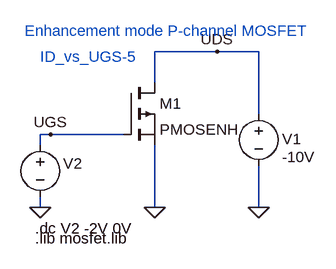
[diagram p0: schematic ID_vs_UGS-7.asc]
ID_vs_UGS-7.asc, the LTspice schematic file:
Version 4
SHEET 1 1292 680
WIRE -624 -176 -720 -176
WIRE -560 -176 -624 -176
WIRE -720 -128 -720 -176
WIRE -560 -80 -560 -176
WIRE -880 -48 -896 -48
WIRE -768 -48 -880 -48
WIRE -896 -32 -896 -48
WIRE -896 64 -896 48
WIRE -720 64 -720 -32
WIRE -560 64 -560 0
FLAG -560 64 0
FLAG -896 64 0
FLAG -720 64 0
FLAG -880 -48 UGS
FLAG -624 -176 UDS
SYMBOL voltage -560 -96 R0
WINDOW 123 0 0 Left 2
WINDOW 39 37 60 Left 2
WINDOW 0 36 55 Left 2
WINDOW 3 36 82 Left 2
SYMATTR InstName V1
SYMATTR Value -10V
SYMBOL voltage -896 -48 R0
WINDOW 123 0 0 Left 2
WINDOW 39 40 53 Left 2
WINDOW 3 -97 181 Left 2
WINDOW 0 35 44 Left 2
SYMATTR Value ""
SYMATTR InstName V2
SYMBOL pmos -768 -128 R0
SYMATTR InstName M1
SYMATTR Value PMOSENH
TEXT -904 96 Left 2 !.dc V2 -2V 0V
TEXT -896 -168 Left 2 ;ID_vs_UGS-5
TEXT -904 112 Left 2 !.lib mosfet.lib
TEXT -920 -208 Left 2 ;Enhancement mode P-channel MOSFET

The netlist it stands for:
* ID_vs_UGS-7.asc
V1 UDS 0 -10V
V2 UGS 0
M1 UDS UGS 0 0 PMOSENH
.model NMOS NMOS
.model PMOS PMOS
.lib standard.mos
.dc V2 -2V 0V
* ID_vs_UGS-5
.lib mosfet.lib
* Enhancement mode P-channel MOSFET
.backanno
.end